# EAGLE schematic power3V3 (EAGLE 9.6.2)
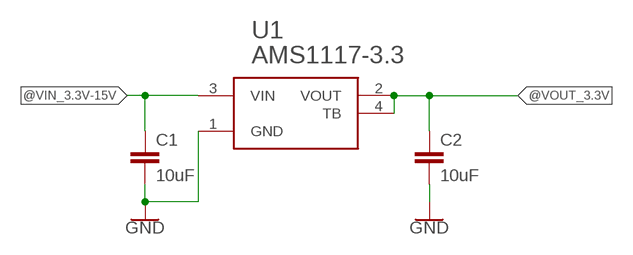
[diagram p0: schematic, sheet 1]

## Parts
C1  10uF  10UF-0603-6.3V-20%  [0603]
C2  10uF  10UF-0603-6.3V-20%  [0603]
U1  AMS1117-3.3  [SOT290P700X180-4N]

## Nets
@VIN_3.3V-15V: C1.1 U1.3(VIN)
@VOUT_3.3V: C2.1 U1.2(VOUT) U1.4(TB)
GND: C1.2 C2.2 U1.1(GND)

## Library data of the parts
C1 C2 = SparkFun-Capacitors:10UF: 10.0µF ceramic capacitors A capacitor is a passive two-terminal electrical component used to store electrical energy temporarily in an electric field.; PROD_ID: CAP-11015
U1 = AMS1117-3.3:AMS1117-3.3: Low Dropout Regulators(LDO) SOT-223 RoHS Source: Datasheet <https://datasheet.lcsc.com/szlcsc/SK-AMS1117-3-3_C165483.pdf>; DESCRIPTION: Low Dropout Regulators(LDO) SOT-223 RoHS; HEIGHT: 1.8mm; MANUFACTURER_NAME: Shikues; MANUFACTURER_PART_NUMBER: AMS1117-3.3